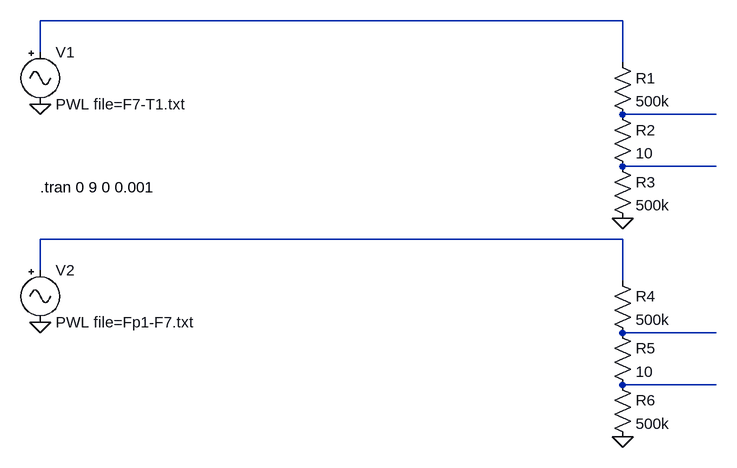
[diagram p0: schematic Test_Preffeto.asc]
Test_Preffeto.asc, the LTspice schematic file:
Version 4
SHEET 1 1056 772
WIRE 368 -80 -528 -80
WIRE -528 -32 -528 -80
WIRE 368 -16 368 -80
WIRE 512 64 368 64
WIRE 512 144 368 144
WIRE 368 256 -528 256
WIRE -528 304 -528 256
WIRE 368 320 368 256
WIRE 512 400 368 400
WIRE 512 480 368 480
FLAG -528 48 0
FLAG 368 224 0
FLAG -528 384 0
FLAG 368 560 0
SYMBOL Misc\\signal -528 -48 R0
WINDOW 123 0 0 Left 0
WINDOW 39 0 0 Left 0
SYMATTR InstName V1
SYMATTR Value PWL file=F7-T1.txt
SYMBOL res 352 -32 R0
SYMATTR InstName R1
SYMATTR Value 500k
SYMBOL res 352 48 R0
SYMATTR InstName R2
SYMATTR Value 10
SYMBOL res 352 128 R0
SYMATTR InstName R3
SYMATTR Value 500k
SYMBOL Misc\\signal -528 288 R0
WINDOW 123 0 0 Left 0
WINDOW 39 0 0 Left 0
SYMATTR InstName V2
SYMATTR Value PWL file=Fp1-F7.txt
SYMBOL res 352 304 R0
SYMATTR InstName R4
SYMATTR Value 500k
SYMBOL res 352 384 R0
SYMATTR InstName R5
SYMATTR Value 10
SYMBOL res 352 464 R0
SYMATTR InstName R6
SYMATTR Value 500k
TEXT -528 176 Left 2 !.tran 0 9 0 0.001

The netlist it stands for:
* Test_Preffeto.asc
V1 N001 0 PWL file=F7-T1.txt
R1 N001 N002 500k
R2 N002 N003 10
R3 N003 0 500k
V2 N004 0 PWL file=Fp1-F7.txt
R4 N004 N005 500k
R5 N005 N006 10
R6 N006 0 500k
.tran 0 9 0 0.001
.backanno
.end